# EAGLE design Ex Controller ExPwr USB Host (EAGLE 7.4.0)
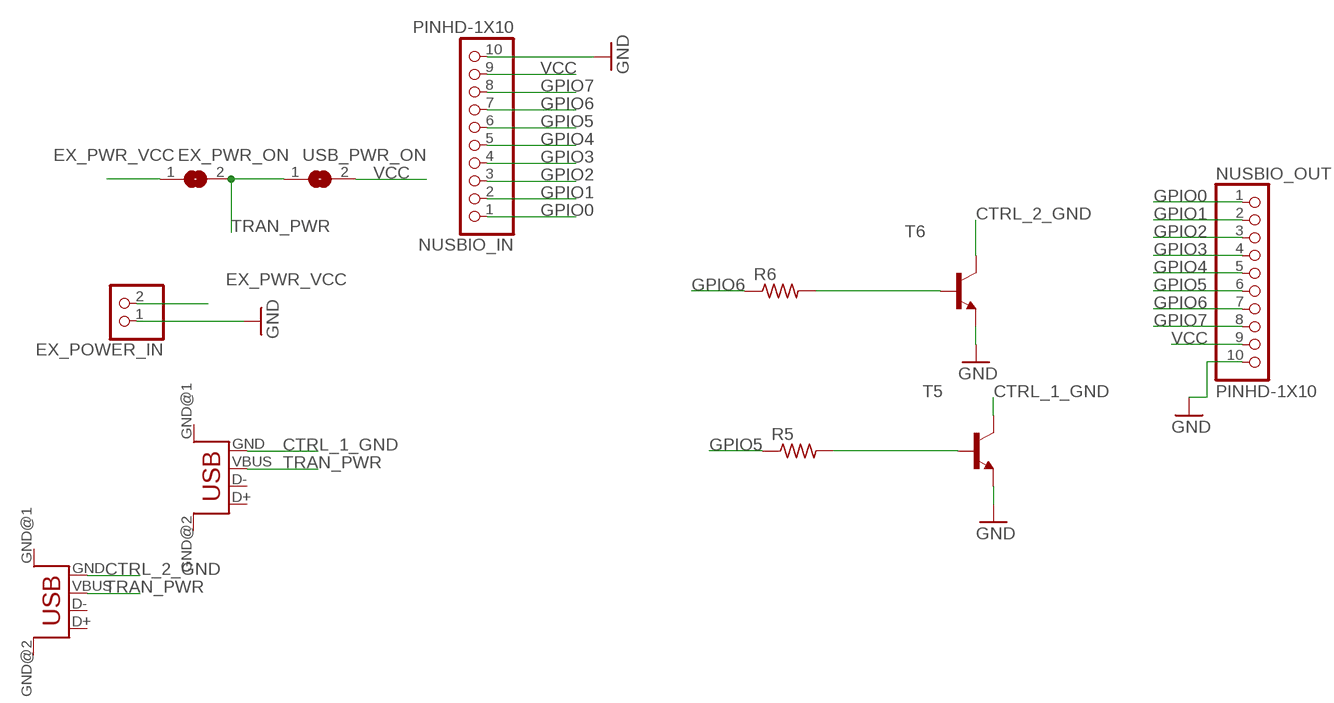
[diagram p0: schematic, sheet 1]

## Parts
EX_DEV_1  USB  [USB-FEMALE-A-PTH]
EX_DEV_2  USB  [USB-FEMALE-A-PTH]
EX_POWER_IN  PINHD-1X2  [1X02]
EX_PWR_ON  SOLDERJUMPERREFLOW  [SOLDERJUMPER_REFLOW]
NUSBIO_IN  PINHD-1X10  [1X10-BIG]
NUSBIO_OUT  PINHD-1X10  [1X10-BIG]
R5  R-US_R0805  [R0805]
R6  R-US_R0805  [R0805]
T5  MMBT3904LT1-NPN-SOT23-BEC  [SOT23-BEC]
T6  MMBT3904LT1-NPN-SOT23-BEC  [SOT23-BEC]
USB_PWR_ON  SOLDERJUMPERREFLOW  [SOLDERJUMPER_REFLOW]

## Nets
CTRL_1_GND: EX_DEV_1.GND T5.C
CTRL_2_GND: EX_DEV_2.GND T6.C
EX_PWR_VCC: EX_POWER_IN.2 EX_PWR_ON.1
GND: EX_POWER_IN.1 NUSBIO_IN.10 NUSBIO_OUT.10 T5.E T6.E
GPIO0: NUSBIO_IN.1 NUSBIO_OUT.1
GPIO1: NUSBIO_IN.2 NUSBIO_OUT.2
GPIO2: NUSBIO_IN.3 NUSBIO_OUT.3
GPIO3: NUSBIO_IN.4 NUSBIO_OUT.4
GPIO4: NUSBIO_IN.5 NUSBIO_OUT.5
GPIO5: NUSBIO_IN.6 NUSBIO_OUT.6 R5.1
GPIO6: NUSBIO_IN.7 NUSBIO_OUT.7 R6.1
GPIO7: NUSBIO_IN.8 NUSBIO_OUT.8
N$2: R5.2 T5.B
N$3: R6.2 T6.B
TRAN_PWR: EX_DEV_1.VBUS EX_DEV_2.VBUS EX_PWR_ON.2 USB_PWR_ON.1
VCC: NUSBIO_IN.9 NUSBIO_OUT.9 USB_PWR_ON.2
Unconnected: EX_DEV_1.D+ EX_DEV_1.D- EX_DEV_1.GND@1(GND) EX_DEV_1.GND@2(GND) EX_DEV_2.D+ EX_DEV_2.D- EX_DEV_2.GND@1(GND) EX_DEV_2.GND@2(GND)

## Library data of the parts
EX_DEV_1 EX_DEV_2 = STUNTAZ:USB: USB Connectors USB-FEMALE-A-PTH: Through hole Female Type A Connector
EX_POWER_IN = pinhead:PINHD-1X2: PIN HEADER
EX_PWR_ON USB_PWR_ON = microbuilder:SOLDERJUMPER: SMD Solder JUMPER Solder the two pads together to create a connection, or remove the solder to break it. REFLOW - Use this footprint for solder paste and reflow ovens. WAVE - Use this footprint for hand-soldering (larger pads). CLOSED - Has a trace between the two pads to ensure it is closed by default. The trace needs to be cut to disable the jumper, and can be closed again by creating a solder bridge between the two pads.
NUSBIO_IN NUSBIO_OUT = adafruit:PINHD-1X10: Pin header 1x10 0.1" spacing With round pins
R5 R6 = adafruit:R-US_: RESISTOR, American symbol
T5 T6 = transistor:*-NPN-: NPN Transistror BF959 corrected 2008.03.06

## Board
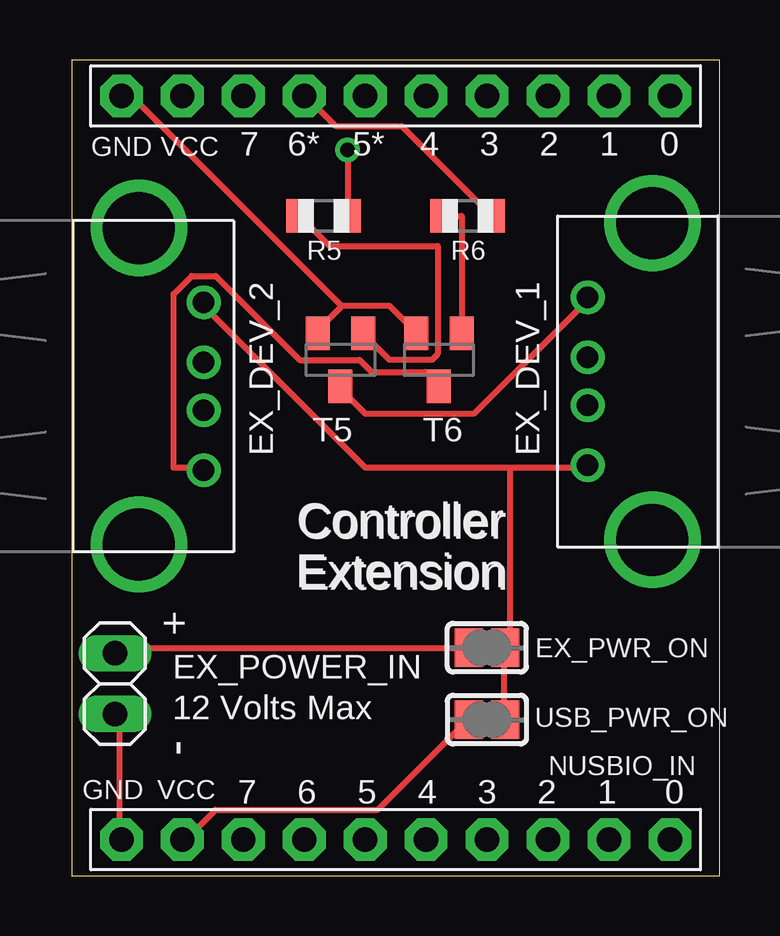
[diagram p1: board, top side]
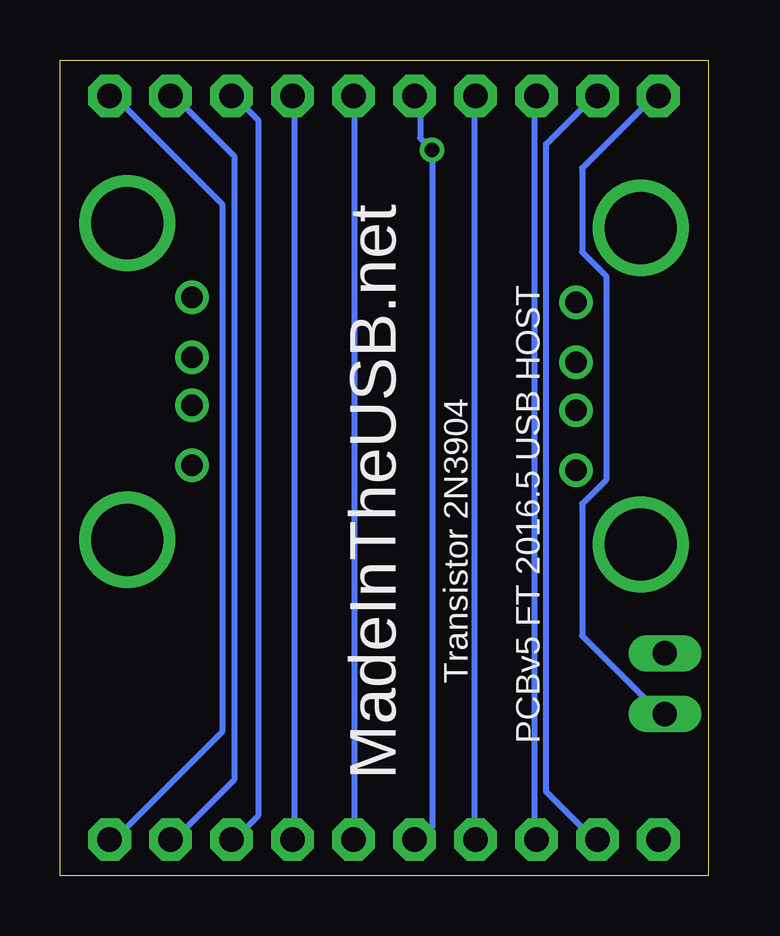
[diagram p2: board, bottom side, seen from below]

Size 27 x 34 mm. Coordinates in mm from the lower left corner, seen from the top.
Outline: 0,0 27,0 27,34 0,34 0,0
Copper layers (1*16): Top 0.035mm / dielectric 1.5mm / Bottom 0.035mm
Design rules "default": minimum track width 10mil, minimum drill 24mil, track to track 8mil, track to pad 8mil, pad to pad 8mil, via to via 8mil, smd to smd 8mil, copper to edge 40mil, drill to drill 8mil, minimum pad ring 10mil, minimum via ring 8mil, stop-mask expansion 4mil, vias tented up to drill 0mil, thermal gap 10mil

### Footprints (pad centres in the part's own frame; a part is rotated, then mirrored left to right if it is on the bottom)
USB-FEMALE-A-PTH = drill 0.9: D+ 5.9,1.3; D- 7.9,1.3; GND 3.4,1.3; VBUS 10.4,1.3 | drill 3: GND@1 13.5,4; GND@2 0.3,4
1X02 = drill 1.016 long: 1 -1.27,0; 2 1.27,0
SOLDERJUMPER_REFLOW = smd 1.168 x 1.6: 1 -0.762,0; 2 0.762,0
1X10-BIG = drill 1.016 pad 1.778 octagon: 1 -11.43,0; 2 -8.89,0; 3 -6.35,0; 4 -3.81,0; 5 -1.27,0; 6 1.27,0; 7 3.81,0; 8 6.35,0; 9 8.89,0; 10 11.43,0
R0805 = smd 1.1 x 1.4: 1 -1,0; 2 1,0
SOT23-BEC = smd 1 x 1.4: B -0.95,-1.1; C 0,1.1; E 0.95,-1.1

### Placement (x,y rotation side)
EX_DEV_1  20.2,27.5 270 top
EX_DEV_2  6.8,13.5 90 top
EX_POWER_IN  1.8,8 90 top
EX_PWR_ON  17.3,9.5 0 top
NUSBIO_IN  13.5,1.5 180 top
NUSBIO_OUT  13.5,32.5 180 top
R5  10.5,27.5 180 top
R6  16.5,27.5 180 top
T5  11.2,21.5 180 top
T6  15.3,21.5 180 top
USB_PWR_ON  17.3,6.5 180 top

### Tracks (layer width: path | path; a pad name or v marks a point on that pad's centre or on a via)
CTRL_1_GND
  Top 0.254: T5.C 11.25,20.25 12.25,19.25 16.75,19.25 21.5,24 EX_DEV_1.GND
CTRL_2_GND
  Top 0.254: T6.C 15.25,20.5 14.75,21 12.5,21 12,21.5 9.5,21.5 6,25 5,25 4.25,24.25 4.25,17 5.5,17 EX_DEV_2.GND
EX_PWR_VCC
  Top 0.254: EX_PWR_ON.1 2,9.5 EX_POWER_IN.2
GND
  Top 0.254: EX_POWER_IN.1 2,6.5 2,1.5 NUSBIO_IN.10 | 11.25,23.75 10.25,22.75 T5.E | 11.25,23.75 13.25,23.75 14.25,22.75 T6.E | 11.25,23.75 2.5,32.5 NUSBIO_OUT.10
  Bottom 0.254: EX_POWER_IN.1 2,6.75 5.25,10 5.25,15.5 4.25,16.5 4.25,25 5.25,26 5.25,29.5 2.25,32.5 NUSBIO_OUT.10
GPIO0
  Bottom 0.254: NUSBIO_IN.1 24.75,1.5 20.25,6 20.25,28 24.75,32.5 NUSBIO_OUT.1
GPIO1
  Bottom 0.254: NUSBIO_IN.2 22.25,1.5 19.75,4 19.75,30 22.25,32.5 NUSBIO_OUT.2
GPIO2
  Bottom 0.254: NUSBIO_IN.3 19.75,1.5 18.75,2.5 18.75,31.5 19.75,32.5 NUSBIO_OUT.3
GPIO3
  Bottom 0.254: NUSBIO_IN.4 17.25,1.5 17.25,32.5 NUSBIO_OUT.4
GPIO4
  Bottom 0.254: NUSBIO_IN.5 14.75,1.5 14.75,32.5 NUSBIO_OUT.5
GPIO5  (via drill 0.61)
  Top 0.254: v11.5,30.25 R5.1
  Bottom 0.254: NUSBIO_OUT.6 12,32.5 12,30.75 v11.5,30.25 11.5,2 12,1.5 NUSBIO_IN.6
GPIO6
  Top 0.254: R6.1 13.75,31.25 11,31.25 9.75,32.5 NUSBIO_OUT.7
  Bottom 0.254: NUSBIO_IN.7 9.75,1.5 9.75,32.5 NUSBIO_OUT.7
GPIO7
  Bottom 0.254: NUSBIO_IN.8 7.25,1.5 7.25,32.5 NUSBIO_OUT.8
N$2
  Top 0.254: T5.B 13.25,21.5 15,21.5 15.25,21.75 15.25,26.25 10.75,26.25 R5.2
N$3
  Top 0.254: T6.B 16.25,27.5 R6.2
TRAN_PWR
  Top 0.254: USB_PWR_ON.1 18,6.5 18,9.5 EX_PWR_ON.2 18.25,9.5 18.25,17 | 18.25,17 21.5,17 EX_DEV_1.VBUS | 18.25,17 12.25,17 5.5,23.75 EX_DEV_2.VBUS
VCC
  Top 0.254: USB_PWR_ON.2 16.5,6.5 12.75,2.75 6,2.75 4.75,1.5 NUSBIO_IN.9
  Bottom 0.254: NUSBIO_OUT.9 4.75,32.5 6.75,30.5 6.75,3.5 4.75,1.5 NUSBIO_IN.9

### Text on the board
tNames: GND | VCC | 7 | 6* | 5* | 4 | 3 | 2 | 1 | 0 | Controller / Extension | Controller / Extension | + | 12 Volts Max | - | GND | VCC | 7 | 6 | 5 | 4 | 3 | 2 | 1 | 0
bNames: Transistor 2N3904 | PCBv5 FT 2016.5 USB HOST | MadeInTheUSB.net